# EAGLE design F3-Quad-Brushed-SIDE-USB-JMPR (EAGLE 7.5.0)
Title: F3 Quad Brushed - Side USB Author: Lance Source: Alienflight.com License: CC BY SA <http://creativecommons.org/licenses/by-sa/4.0/>
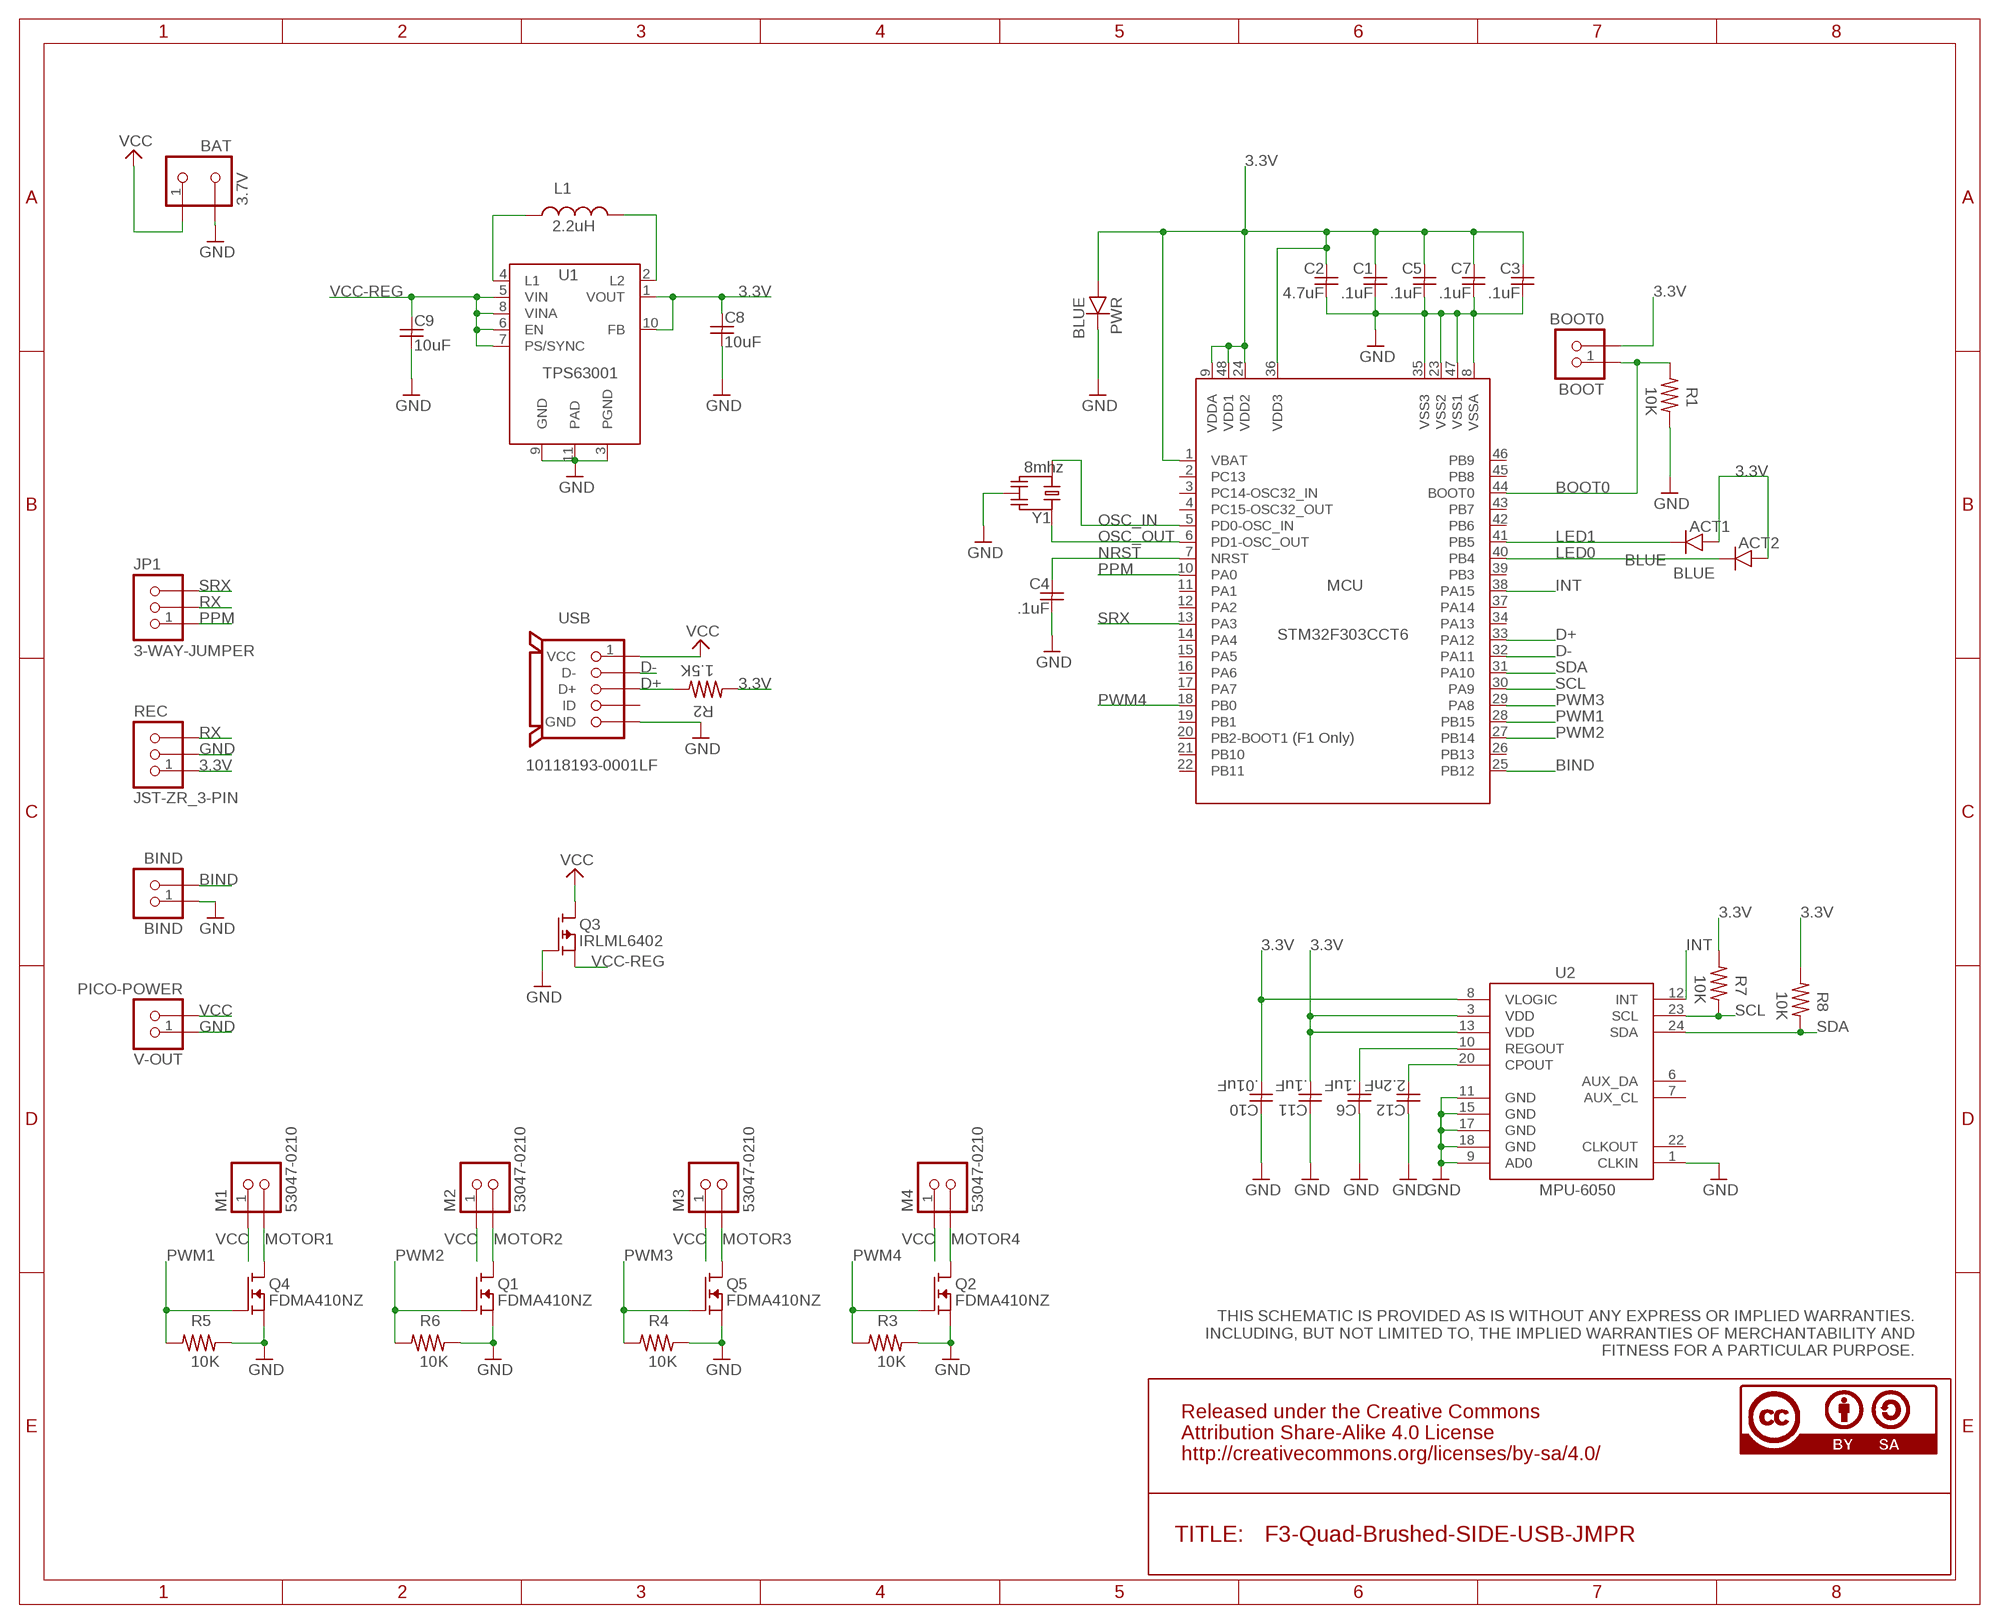
[diagram p0: schematic, sheet 1]

## Parts
ACT1  BLUE  SMD-CHIP-LED-0805  [SMD-CHIP-LED-0805]
ACT2  BLUE  SMD-CHIP-LED-0805  [SMD-CHIP-LED-0805]
BAT  3.7V  JST-PH-BAT  [S2B-PH-K-S]
BIND  BIND  1.27MM-PINHEADX2  [1.27MM-PINHEADX2]
BOOT  BOOT0  1.27MM-PINHEADX2  [1.27MM-PINHEADX2]
C1  .1uF  CAPACITOR.1UF  [MUR-CAP-0603]
C2  4.7uF  CAPACITOR4.7UF  [MUR-CAP-0603]
C3  .1uF  CAPACITOR.1UF  [MUR-CAP-0603]
C4  .1uF  CAPACITOR.1UF  [MUR-CAP-0603]
C5  .1uF  CAPACITOR.1UF  [MUR-CAP-0603]
C6  .1uF  CAPACITOR.1UF  [MUR-CAP-0603]
C7  .1uF  CAPACITOR.1UF  [MUR-CAP-0603]
C8  10uF  CAPACITOR10UF  [YUDEN-CAP-0805]
C9  10uF  CAPACITOR10UF  [YUDEN-CAP-0805]
C10  .01uF  CAPACITOR.01UF  [MUR-CAP-0603]
C11  .1uF  CAPACITOR.1UF  [MUR-CAP-0603]
C12  2.2nF  CAPACITOR2.2NF  [MUR-CAP-0603]
JP1  3-WAY-JUMPER  [3-WAY-JUMPER]
L1  2.2uH  NR301X  [NR301X]
M1  53047-0210  PICO-1.25-MOTOR  [PICO-53047-02]
M2  53047-0210  PICO-1.25-MOTOR  [PICO-53047-02]
M3  53047-0210  PICO-1.25-MOTOR  [PICO-53047-02]
M4  53047-0210  PICO-1.25-MOTOR  [PICO-53047-02]
MCU  STM32F303CCT6  STM32FX03-F3  [LQFP48-7X7]
PWR  BLUE  SMD-CHIP-LED-0805  [SMD-CHIP-LED-0805]
Q1  FDMA410NZ  [MICROFET-2X2]
Q2  FDMA410NZ  [MICROFET-2X2]
Q3  IRLML6402  MOSFET-P  [SOT-23]
Q4  FDMA410NZ  [MICROFET-2X2]
Q5  FDMA410NZ  [MICROFET-2X2]
R1  10K  RESISTOR10K  [VISH-RES-0603]
R2  1.5K  RESISTOR1.5K  [VISH-RES-0603]
R3  10K  RESISTOR10K  [VISH-RES-0603]
R4  10K  RESISTOR10K  [VISH-RES-0603]
R5  10K  RESISTOR10K  [VISH-RES-0603]
R6  10K  RESISTOR10K  [VISH-RES-0603]
R7  10K  RESISTOR10K  [VISH-RES-0603]
R8  10K  RESISTOR10K  [VISH-RES-0603]
REC  JST-ZR_3-PIN  [S3B-ZR]
U1  TPS63001  TPS630XX-TPS63001  [VSON-N10]
U2  MPU-6050  [QFN24-4X4]
USB  10118193-0001LF  USB-MICRO-B-FCI  [10118193-0001LF]
V-OUT  PICO-POWER  [PICO_1.25_.5MM]
Y1  8mhz  RESONATOR8MHZ  [RESONATOR_8]

## Nets
3.3V: ACT1.A ACT2.A BOOT.2 C1.1 C2.1 C3.1 C5.1 C7.1 C8.1 C10.2 C11.2 MCU.1(VBAT) MCU.9(VDDA) MCU.24(VDD2) MCU.36(VDD3) MCU.48(VDD1) PWR.A R2.2 R7.2 R8.2 REC.1 U1.1(VOUT) U1.10(FB) U2.3(VDD) U2.8(VLOGIC) U2.13(VDD)
BIND: BIND.2 MCU.25(PB12)
BOOT0: BOOT.1 MCU.44(BOOT0) R1.2
D+: MCU.33(PA12) R2.1 USB.3(D+)
D-: MCU.32(PA11) USB.2(D-)
GND: BAT.2 BIND.1 C1.2 C2.2 C3.2 C4.2 C5.2 C6.1 C7.2 C8.2 C9.2 C10.1 C11.1 C12.1 MCU.8(VSSA) MCU.23(VSS2) MCU.35(VSS3) MCU.47(VSS1) PWR.C Q1.S Q1.S1(S) Q2.S Q2.S1(S) Q3.1(G) Q4.S Q4.S1(S) Q5.S Q5.S1(S) R1.1 R3.1 R4.1 R5.1 R6.1 REC.2 U1.3(PGND) U1.9(GND) U1.11(PAD) U2.1(CLKIN) U2.9(AD0) U2.11(GND) U2.15(GND) U2.17(GND) U2.18(GND) USB.5(GND) USB.GND USB.GND2(GND) USB.HOLE1(GND) USB.HOLE2(GND) V-OUT.1 Y1.2
INT: MCU.38(PA15) U2.12(INT)
LED0: ACT2.C MCU.40(PB4)
LED1: ACT1.C MCU.41(PB5)
MOTOR1: M1.2 Q4.D Q4.D1(D) Q4.D2(D) Q4.D3(D) Q4.D4(D)
MOTOR2: M2.2 Q1.D Q1.D1(D) Q1.D2(D) Q1.D3(D) Q1.D4(D)
MOTOR3: M3.2 Q5.D Q5.D1(D) Q5.D2(D) Q5.D3(D) Q5.D4(D)
MOTOR4: M4.2 Q2.D Q2.D1(D) Q2.D2(D) Q2.D3(D) Q2.D4(D)
N$1: C6.2 U2.10(REGOUT)
N$7: C12.2 U2.20(CPOUT)
N$8: L1.2 U1.2(L2)
N$9: L1.1 U1.4(L1)
NRST: C4.1 MCU.7(NRST)
OSC_IN: MCU.5(PD0-OSC_IN) Y1.3
OSC_OUT: MCU.6(PD1-OSC_OUT) Y1.1
PPM: JP1.1 MCU.10(PA0)
PWM1: MCU.28(PB15) Q4.G R5.2
PWM2: MCU.27(PB14) Q1.G R6.2
PWM3: MCU.29(PA8) Q5.G R4.2
PWM4: MCU.18(PB0) Q2.G R3.2
RX: JP1.2 REC.3
SCL: MCU.30(PA9) R7.1 U2.23(SCL)
SDA: MCU.31(PA10) R8.1 U2.24(SDA)
SRX: JP1.3 MCU.13(PA3)
VCC [vcc]: BAT.1 M1.1 M2.1 M3.1 M4.1 Q3.3(D) USB.1(VCC) V-OUT.2
VCC-REG [vcc]: C9.1 Q3.2(S) U1.5(VIN) U1.6(EN) U1.7(PS/SYNC) U1.8(VINA)
Unconnected: MCU.2(PC13) MCU.3(PC14-OSC32_IN) MCU.4(PC15-OSC32_OUT) MCU.11(PA1) MCU.12(PA2) MCU.14(PA4) MCU.15(PA5) MCU.16(PA6) MCU.17(PA7) MCU.19(PB1) MCU.20(PB2-BOOT1) MCU.21(PB10) MCU.22(PB11) MCU.26(PB13) MCU.34(PA13) MCU.37(PA14) MCU.39(PB3) MCU.42(PB6) MCU.43(PB7) MCU.45(PB8) MCU.46(PB9) U2.6(AUX_DA) U2.7(AUX_CL) U2.22(CLKOUT) USB.4(ID)

## Notes on the sheet
- THIS SCHEMATIC IS PROVIDED AS IS WITHOUT ANY EXPRESS OR IMPLIED WARRANTIES.
   INCLUDING, BUT NOT LIMITED TO, THE IMPLIED WARRANTIES OF MERCHANTABILITY AND
   FITNESS FOR A PARTICULAR PURPOSE.

## Library data of the parts
ACT1 ACT2 PWR = alienflight:SMD-CHIP-LED-0805: SMD CHIP LED APHCM2012QBC/D-F01 View Datasheet <https://www.kingbrightusa.com/images/catalog/spec/APHCM2012QBC-D-F01.pdf> Author: Lance Source: http://alienflight.com License: CC BY SA <creativecommons.org/licenses/by-sa/4.0/>; MF: Kingbright; MPN: APHCM2012QBC/D-F01
BAT = alienflight:JST-PH-BAT: Battery Connector JST- S2B-PH-K-S View Datasheet <http://www.jst-mfg.com/product/pdf/eng/ePH.pdf> Author: Lance Source: http://alienflight.com License: CC BY SA <creativecommons.org/licenses/by-sa/4.0/>; MF: JST; MPN: S2B-PH-K-S
BIND BOOT = alienflight:1.27MM-PINHEADX2: Jumper 1.27MM Pin Header X2 View Datasheet <http://www.sullinscorp.com/catalogs/82_PAGE90-91_.050_MALE_HDR_ST_RA_SMT.pdf> Author: Lance Source: http://alienflight.com License: CC BY SA <creativecommons.org/licenses/by-sa/4.0/>; MF: Sullins; MPN: GRPB021VWVN-RC (JUMPER IS M50-1930005)
C1 C3-C7 C11 = alienflight:CAPACITOR: CAPACITORS Murata Datasheet <http://www.murata.com/~/media/webrenewal/support/library/catalog/products/capacitor/mlcc/c02e.ashx?la=en-us> Taiyo Yuden Datasheet <http://www.mouser.com/ds/2/396/mlcc11_hq_e-541564.pdf> Author: Lance Source: http://alienflight.com License: CC BY SA <creativecommons.org/licenses/by-sa/4.0/>; MF: Murata; MPN: GRM188R71C104KA01D
C2 = alienflight:CAPACITOR: CAPACITORS Murata Datasheet <http://www.murata.com/~/media/webrenewal/support/library/catalog/products/capacitor/mlcc/c02e.ashx?la=en-us> Taiyo Yuden Datasheet <http://www.mouser.com/ds/2/396/mlcc11_hq_e-541564.pdf> Author: Lance Source: http://alienflight.com License: CC BY SA <creativecommons.org/licenses/by-sa/4.0/>; MF: Murata; MPN: GRJ188C70J475KE11D
C8 C9 = alienflight:CAPACITOR: CAPACITORS Murata Datasheet <http://www.murata.com/~/media/webrenewal/support/library/catalog/products/capacitor/mlcc/c02e.ashx?la=en-us> Taiyo Yuden Datasheet <http://www.mouser.com/ds/2/396/mlcc11_hq_e-541564.pdf> Author: Lance Source: http://alienflight.com License: CC BY SA <creativecommons.org/licenses/by-sa/4.0/>; MF: Taiyo Yuden; MPN: JMK212AB7106KG-T
C10 = alienflight:CAPACITOR: CAPACITORS Murata Datasheet <http://www.murata.com/~/media/webrenewal/support/library/catalog/products/capacitor/mlcc/c02e.ashx?la=en-us> Taiyo Yuden Datasheet <http://www.mouser.com/ds/2/396/mlcc11_hq_e-541564.pdf> Author: Lance Source: http://alienflight.com License: CC BY SA <creativecommons.org/licenses/by-sa/4.0/>; MF: Murata; MPN: GRM188R71C103KA01D
C12 = alienflight:CAPACITOR: CAPACITORS Murata Datasheet <http://www.murata.com/~/media/webrenewal/support/library/catalog/products/capacitor/mlcc/c02e.ashx?la=en-us> Taiyo Yuden Datasheet <http://www.mouser.com/ds/2/396/mlcc11_hq_e-541564.pdf> Author: Lance Source: http://alienflight.com License: CC BY SA <creativecommons.org/licenses/by-sa/4.0/>; MF: Murata; MPN: GRM188R71C222KA01D
JP1 = alienflight:3-WAY-JUMPER: 3 Way Jumper
L1 = alienflight:NR301X: 3X3mm Inductor NR3015T2R2M - Datasheet <http://datasheet.octopart.com/NR3015T2R2M-Taiyo-Yuden-datasheet-41181804.pdf> Author: Lance Source: http://alienflight.com License: CC BY SA <creativecommons.org/licenses/by-sa/4.0/>; MF: Taiyo Yuden; MPN: NR3015T2R2M
M1-M4 = alienflight:PICO-1.25-MOTOR: Motor Connector PicoBlade 1.25 53047-02 View Datasheet <http://www.molex.com/webdocs/datasheets/pdf/en-us/0530470210_PCB_HEADERS.pdf> Author: Lance Source: http://alienflight.com License: CC BY SA <creativecommons.org/licenses/by-sa/4.0/>; MF: MOLEX; MPN: 53047-0210
MCU = alienflight:STM32FX03: STM32F32FX03 Datasheet <http://www.st.com/web/en/resource/technical/document/datasheet/DM00058181.pdf> Author: Lance Source: http://alienflight.com License: CC BY SA <creativecommons.org/licenses/by-sa/4.0/>; MF: ST; MPN: STM32F303CCT6
Q1 Q2 Q4 Q5 = alienflight:FDMA410NZ: N-Channel MOSFET FDMA410NZ View Datasheet <https://www.fairchildsemi.com/datasheets/FD/FDMA410NZ.pdf> Author: Lance Source: http://alienflight.com License: CC BY SA <creativecommons.org/licenses/by-sa/4.0/>; MF: Fairchild; MPN: FDMA410NZ
Q3 = alienflight:MOSFET-P: P-Channel MOSFET IRLML6402 Datasheet <http://www.irf.com/product-info/datasheets/data/irlml6402pbf.pdf> Author: Lance Source: Alienflight.com License: CC BY SA <creativecommons.org/licenses/by-sa/4.0/>; MF: IR; MPN: IRLML6402
R1 R3-R8 = alienflight:RESISTOR: RESISTORS Vishay DataSheet <http://www.vishay.com/docs/20043/crcwhpe3.pdf> Author: Lance Source: http://alienflight.com License: CC BY SA <creativecommons.org/licenses/by-sa/4.0/>; MF: Vishay; MPN: CRCW060310K0FKEAHP
R2 = alienflight:RESISTOR: RESISTORS Vishay DataSheet <http://www.vishay.com/docs/20043/crcwhpe3.pdf> Author: Lance Source: http://alienflight.com License: CC BY SA <creativecommons.org/licenses/by-sa/4.0/>; MF: Vishay; MPN: CRCW06031K50FKEAHP
REC = alienflight:JST-ZR_3-PIN: 3 Pin Receiver JST - S3B-ZR View Datasheet <http://www.jst-mfg.com/product/pdf/eng/eZH.pdf> Author: Lance Source: http://alienflight.com License: CC BY SA <creativecommons.org/licenses/by-sa/4.0/>; MF: JST; MPN: S3B-ZR
U1 = alienflight:TPS630XX: Buck/Boost Converter TPS63001/2 Datasheet <http://www.ti.com/lit/ds/symlink/tps63001.pdf> Author: Lance Source: http://alienflight.com License: CC BY SA <creativecommons.org/licenses/by-sa/4.0/>; MF: TI; MPN: TPS63001DRCR
U2 = alienflight:MPU-6050: MPU-6050 View Datasheet <http://43zrtwysvxb2gf29r5o0athu.wpengine.netdna-cdn.com/wp-content/uploads/2015/02/MPU-6000-Datasheet1.pdf> Author: Lance Source: http://alienflight.com License: CC BY SA <creativecommons.org/licenses/by-sa/4.0/>; MF: Invensense; MPN: MPU-6050
USB = alienflight:USB-MICRO-B: Micro-B USB Connector Author: Lance Source: http://alienflight.com License: CC BY SA <creativecommons.org/licenses/by-sa/4.0/>; MF: FCI; MPN: 10118193-0001LF
V-OUT = alienflight:PICO-POWER: Pico Power Connector Picoblade 53047-0210 View Datasheet <http://www.molex.com/webdocs/datasheets/pdf/en-us/0530470210_PCB_HEADERS.pdf> Author: Lance Source: http://alienflight.com License: CC BY SA <creativecommons.org/licenses/by-sa/4.0/>; MF: Molex; MPN: 53047-0210
Y1 = alienflight:RESONATOR: SMD Ceramic Resonators Ceralock Murata Datasheet <http://www.murata.com/~/media/webrenewal/support/library/catalog/products/timingdevice/ceralock/p16e.ashx> Author: Lance Source: http://alienflight.com License: CC BY SA <creativecommons.org/licenses/by-sa/4.0/>; MF: Murata; MPN: CSTCE8M00G55-R0

## Net classes
0 default: width 0.254 mm, drill 0.33 mm, clearance 0.178 mm
1 vcc: width 0.254 mm, drill 0.33 mm, clearance 0.178 mm

## Board
Title: F3 Quad Brushed - Side USB Author: Lance Source: Alienflight.com License: CC BY SA <http://creativecommons.org/licenses/by-sa/4.0/>
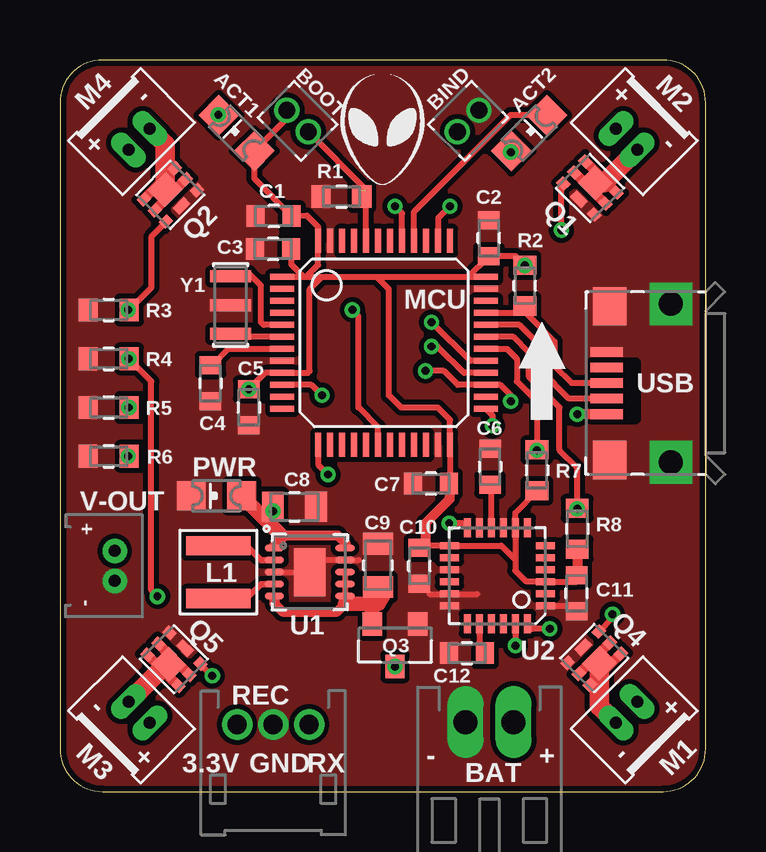
[diagram p1: board, top side]
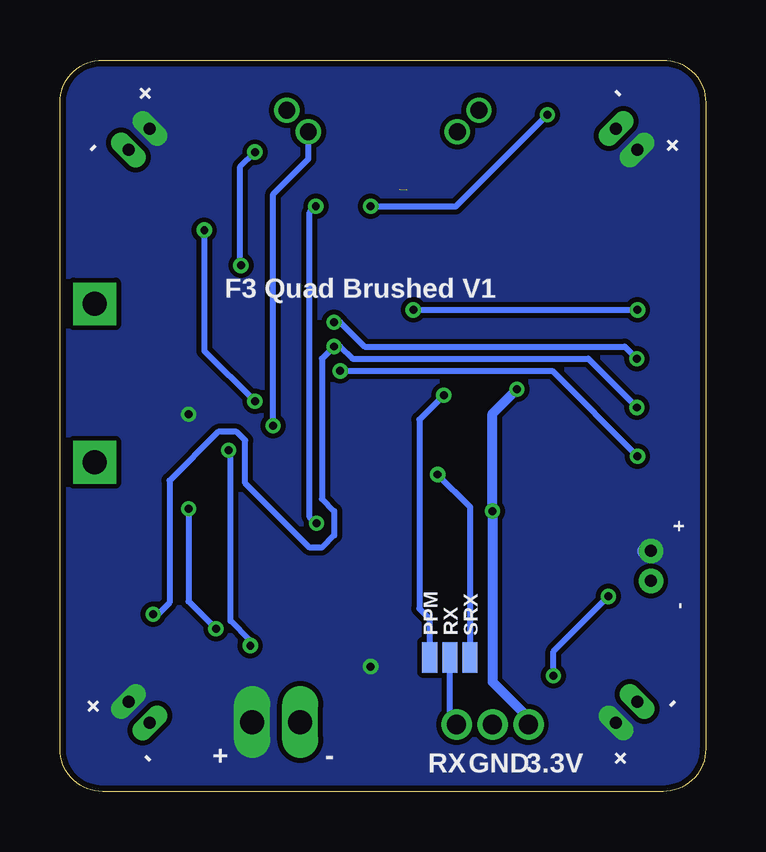
[diagram p2: board, bottom side, seen from below]

Size 26.92 x 30.48 mm. Coordinates in mm from the lower left corner, seen from the top.
Outline: 0,28.7 0,1.78 arc90 1.78,0 25.15,0 arc90 26.92,1.78 26.92,28.7 arc90 25.15,30.48 1.78,30.48 arc90 0,28.7
Copper layers (1*16): Top 0.035mm / dielectric 1.5mm / Bottom 0.035mm
Design rules "Alien-Design-Rules": minimum track width 6mil, minimum drill 12mil, track to track 6mil, track to pad 6mil, pad to pad 6mil, via to via 6mil, smd to smd 0mil, copper to edge 10mil, drill to drill 10mil, minimum pad ring 7mil, minimum via ring 6mil, stop-mask expansion 0mil, vias tented up to drill 20mil, thermal gap 10mil

### Footprints (pad centres in the part's own frame; a part is rotated, then mirrored left to right if it is on the bottom)
SMD-CHIP-LED-0805 = smd 1.2 x 1.2: A -1.05,0; C 1.05,0
S2B-PH-K-S = drill 1 long: 1 1,0; 2 -1,0
1.27MM-PINHEADX2 = drill 0.7: 1 -0.635,0; 2 0.635,0
MUR-CAP-0603 = smd 0.75 x 0.9: 1 -0.75,0; 2 0.75,0
YUDEN-CAP-0805 = smd 0.9 x 1.25: 1 -0.9,0; 2 0.9,0
3-WAY-JUMPER = smd 0.635 x 1.27: 1 -0.84,0; 2 0,0; 3 0.84,0
NR301X = smd 2.7 x 0.8: 1 0,1.1; 2 0,-1.1
PICO-53047-02 = drill 0.5 pad 0.813 long: 1 0.625,0; 2 -0.625,0
LQFP48-7X7 = smd 0.254 x 1: 1 -2.75,-4.25; 2 -2.25,-4.25; 3 -1.75,-4.25; 4 -1.25,-4.25; 5 -0.75,-4.25; 6 -0.25,-4.25; 7 0.25,-4.25; 8 0.75,-4.25; 9 1.25,-4.25; 10 1.75,-4.25; 11 2.25,-4.25; 12 2.75,-4.25; 25 2.75,4.25; 26 2.25,4.25; 27 1.75,4.25; 28 1.25,4.25; 29 0.75,4.25; 30 0.25,4.25; 31 -0.25,4.25; 32 -0.75,4.25; 33 -1.25,4.25; 34 -1.75,4.25; 35 -2.25,4.25; 36 -2.75,4.25 | smd 1 x 0.254: 13 4.25,-2.75; 14 4.25,-2.25; 15 4.25,-1.75; 16 4.25,-1.25; 17 4.25,-0.75; 18 4.25,-0.25; 19 4.25,0.25; 20 4.25,0.75; 21 4.25,1.25; 22 4.25,1.75; 23 4.25,2.25; 24 4.25,2.75; 37 -4.25,2.75; 38 -4.25,2.25; 39 -4.25,1.75; 40 -4.25,1.25; 41 -4.25,0.75; 42 -4.25,0.25; 43 -4.25,-0.25; 44 -4.25,-0.75; 45 -4.25,-1.25; 46 -4.25,-1.75; 47 -4.25,-2.25; 48 -4.25,-2.75
MICROFET-2X2 = smd 1 x 1.05: D -0.3,0 | smd 0.4 x 0.47: D1 -0.65,0.915; D2 0,0.915; D3 -0.65,-0.915; D4 0,-0.915; G 0.65,-0.915; S1 0.65,0.915 | smd 0.4 x 0.66: S 0.65,0
SOT-23 = smd 0.802 x 0.972: 1 -0.95,-0.885; 2 0.95,-0.885; 3 0,0.885
VISH-RES-0603 = smd 0.8 x 0.95: 1 -0.85,0; 2 0.85,0
S3B-ZR = drill 0.8 pad 1.27: 1 -1.5,0; 2 0,0; 3 1.5,0
VSON-N10 = smd 0.8 x 0.26: 1 -1.475,1; 2 -1.475,0.5; 3 -1.475,0; 4 -1.475,-0.5; 5 -1.475,-1; 6 1.475,-1; 7 1.475,-0.5; 8 1.475,0; 9 1.475,0.5; 10 1.475,1 | smd 1.3 x 2: 11 0,0
QFN24-4X4 = smd 0.8 x 0.3: 1 -2,1.25; 2 -2,0.75; 3 -2,0.25; 4 -2,-0.25; 5 -2,-0.75; 6 -2,-1.25; 13 2,-1.25; 14 2,-0.75; 15 2,-0.25; 16 2,0.25; 17 2,0.75; 18 2,1.25 | smd 0.3 x 0.8: 7 -1.25,-2; 8 -0.75,-2; 9 -0.25,-2; 10 0.25,-2; 11 0.75,-2; 12 1.25,-2; 19 1.25,2; 20 0.75,2; 21 0.25,2; 22 -0.25,2; 23 -0.75,2; 24 -1.25,2
10118193-0001LF = smd 0.4 x 1.35: 1 1.3,-4.125; 2 0.65,-4.125; 3 0,-4.125; 4 -0.65,-4.125; 5 -1.3,-4.125 | smd 1.6 x 1.4: GND -3.2,-4; GND2 3.2,-4 | drill 1 pad 1.778 square: HOLE1 -3.3,-1.45; HOLE2 3.3,-1.45
PICO_1.25_.5MM = drill 0.5 pad 1.016: 1 0.625,0; 2 -0.625,0
RESONATOR_8 = smd 0.5 x 1.7: 1 -1.2,0; 2 0,0; 3 1.2,0

### Placement (x,y rotation side)
ACT1  7.37,27.43 135 top
ACT2  19.56,27.43 45 top
BAT  17.91,2.9 0 top
BIND  17.02,27.94 225 top
BOOT  9.91,27.94 135 top
C1  8.92,23.98 180 top
C2  17.88,23.06 90 top
C3  8.89,22.61 180 top
C4  6.27,17.02 270 top
C5  7.87,16 270 top
C6  17.93,13.54 270 top
C7  15.47,12.83 180 top
C8  9.78,11.86 0 top
C9  13.26,9.42 90 top
C10  14.99,9.4 90 top
C11  21.54,8.26 90 top
C12  16.97,5.77 0 top
JP1  10.67,5.59 0 bottom
L1  6.6,9.14 180 top
M1  23.62,3.3 45 top
M2  23.62,27.18 135 top
M3  3.3,3.3 315 top
M4  3.3,27.18 225 top
MCU  13.51,18.69 270 top
PWR  6.53,12.32 180 top
Q1  22.1,25.15 225 top
Q2  4.6,24.86 315 top
Q3  13.97,6.1 180 top
Q4  22.28,5.56 135 top
Q5  4.75,5.51 45 top
R1  11.73,24.79 0 top
R2  19.38,21.08 90 top
R3  2.03,20.07 0 top
R4  2.03,18.03 0 top
R5  2.03,16 0 top
R6  2.03,13.97 0 top
R7  19.89,13.39 270 top
R8  21.56,10.95 270 top
REC  8.89,2.79 0 top
U1  10.41,9.14 0 top
U2  18.24,8.99 180 top
U$1  [ALIENHEADSMALL]  13.46,27.94 0 top
U$2  [ARROW]  20.07,17.02 0 top
USB  26.92,17.02 270 top
V-OUT  2.29,9.4 270 top
Y1  7.11,20.27 90 top

### Tracks (layer width: path | path; a pad name or v marks a point on that pad's centre or on a via)
3.3V  (via drill 0.33)
  Top 0.254: U1.1 8.91,10.23 8.91,10.24 | 11.91,10.27 U1.10 | C11.2 21.54,8.74 U2.3 19.45,8.74 18.99,9.21 18.99,9.65 | 19.94,12.45 R7.2 18.99,11.61 U2.8 18.99,9.65 | 18.99,9.65 18.4,10.24 U2.13 15.08,10.24 C10.2 | 8.13,26.92 ACT1.A | 8.38,26.92 8.13,26.92 | 8.13,26.92 ACT1.A | v19.38,21.92 19.37,22.02 R2.2 19,22.31 C2.1 17.02,21.44 | ACT2.A v18.8,26.64 | 8.13,26.67 ACT1.A | 10.27,21.44 10.92,21.44 | 10.92,21.44 13.21,21.44 | 13.21,21.44 17.02,21.44 | 17.02,21.44 MCU.36 | MCU.1 10.16,21.44 | 10.16,21.44 10.27,21.44 | 10.27,21.44 10.76,21.94 MCU.48 10.76,23.53 10.29,24 C1.1 8.11,25.54 ACT1.A | 10.92,21.44 10.41,20.94 10.41,17.53 10.33,17.44 MCU.9 8.55,17.44 v7.87,16.76 C5.1 | C7.1 16.26,13.05 MCU.24 16.26,15.49 15.75,16 14.22,16 13.72,16.51 13.72,20.94 13.21,21.44 | 19.36,22.02 v19.38,21.92 | C3.1 9.64,21.96 10.16,21.44 | 19.28,21.84 v19.38,21.92 | C8.1 8.88,11.7 v8.89,11.68 | BOOT.2 9.46,28.04 ACT1.A
  Top 0.305: 11.91,10.27 11.92,10.2
  Top 0.406: 11.91,10.27 11.91,10.34 11.58,10.67 9.37,10.67 9.26,10.55 | 9.26,10.55 8.94,10.23 8.91,10.23 | R8.2 21.57,9.01 C11.2 | 9.26,10.55 9.26,10.64 9.18,10.72 9.18,10.86 8.89,11.15 v8.89,11.68 8.9,11.68 | C10.2 15.24,10.4 15.24,11.18 16.26,12.19 16.26,12.79 C7.1 16.07,12.68
  Top 0.61: 9.18,10.72 PWR.A 7.73,12.42
  Bottom 0.254: v18.8,26.64 19.41,26.04 19.41,21.95 v19.38,21.92
  Bottom 0.406: v7.87,16.76 8.89,15.75 v8.89,11.68 8.89,4.57 7.39,3.07 REC.1
BIND  (via drill 0.33)
  Top 0.254: MCU.25 18.03,15.67 v18.03,15.24
  Bottom 0.254: v18.03,15.24 18.03,24.89 16.57,26.36 BIND.2
BOOT0  (1 unrouted)
  Top 0.254: MCU.44 12.76,25.08 BOOT.1 | R1.2 12.46,25.04
D+
  Top 0.254: USB.3 21.34,17.02 20.62,17.73 20.62,18.75 19.43,19.94 19.3,19.94 | MCU.33 19.3,19.94 | R2.1 19.36,20 19.3,19.94
D-
  Top 0.254: USB.2 21.22,16.37 20.07,17.53 20.07,18.54 19.16,19.44 MCU.32
GND
  Top 0.254: U1.3 U1.11 10.41,9.65 10.42,9.64 U1.9 12.45,9.64 | U2.1 21.57,7.74 C11.1 | 15.42,8.23 17.4,8.23
  pour Top (isolate 0.203, no thermals): 0.1,28.5 0.1,1.83 arc90 1.88,0.05 24.99,0.05 arc90 26.77,1.83 26.77,28.5 arc90 24.99,30.28 1.88,30.28 arc90
INT  (via drill 0.33)
  Top 0.254: MCU.38 15.76,23.89 v16.26,24.38 | U2.12 16.8,11.18 v16.23,11.18
  Bottom 0.254: 16.48,24.16 v16.26,24.38 16.51,24.13 16.51,11.43 16.26,11.18 v16.23,11.18
LED0
  Top 0.254: 20.32,28.19 ACT2.C | 20.07,27.94 ACT2.C | ACT2.C 20.28,28.19 18.8,28.19 14.76,24.16 MCU.40
LED1  (via drill 0.33)
  Top 0.254: MCU.41 14.26,24.09 v13.97,24.38 | v6.6,28.19 6.86,27.94 ACT1.C
  Bottom 0.254: v13.97,24.38 10.41,24.38 v6.6,28.19
MOTOR1
  Top 0.406: Q4.D1 22.47,4.83 22.49,4.83 22.49,4.85 Q4.D3 | Q4.D4 | Q4.D1 | Q4.D2 22.07,5.34 Q4.D 22.49,5.77 Q4.D4
  Top 0.813: Q4.D 22.49,4.83 22.49,3.55 M1.2
MOTOR2
  Top 0.406: Q1.D4 21.89,25.36 Q1.D | Q1.D2 22.31,24.93 Q1.D | Q1.D1 22.79,25.37 | 22.79,25.37 22.79,25.47 | Q1.D3 22.76,25.4 | 22.76,25.4 22.86,25.4 22.82,25.36 Q1.D | 22.76,25.4 22.79,25.37
  Top 0.813: 22.69,25.36 22.79,25.47 M2.2
MOTOR3
  Top 0.406: Q5.D2 4.54,5.73 Q5.D | Q5.D4 4.96,5.3 Q5.D | Q5.D3 4.54,4.81 Q5.D | Q5.D1 4.13,5.22 4.13,5.01
  Top 0.813: M3.2 4.13,5.01 4.42,5.3 Q5.D
MOTOR4
  Top 0.406: Q2.D1 | Q2.D2 | Q2.D4 | Q2.D2 4.82,25.07 Q2.D 4.39,24.65 Q2.D4 | Q2.D3 4.39,25.57 4.39,25.65 | Q2.D1 4.73,25.91 4.39,25.91
  Top 0.813: M4.2 4.39,26.97 4.39,25.91 4.39,25.65 Q2.D
N$1
  Top 0.254: U2.10 17.99,12.73 C6.2
N$7
  Top 0.254: U2.20 17.49,5.56 C12.2
N$8
  Top 0.279: U1.2 8.39,9.64 7.87,10.16 6.7,10.16 L1.2
N$9
  Top 0.279: U1.4 8.39,8.64 7.87,8.13 6.69,8.13 L1.1
NRST
  Top 0.254: C4.1 6.34,17.77 7.01,18.44 MCU.7
OSC_IN
  Top 0.254: MCU.5 8.5,19.44 8.38,19.56 8.38,21.08 7.87,21.59 7.23,21.59 Y1.3 7.13,21.46
OSC_OUT
  Top 0.254: MCU.6 7.24,18.94 Y1.1
PPM  (via drill 0.33)
  Top 0.254: v10.92,16.51 10.49,16.94 MCU.10
  Bottom 0.254: v10.92,16.51 11.94,15.49 11.94,7.62 11.51,7.19 JP1.1
PWM1  (via drill 0.33)
  Top 0.254: v2.87,16 R5.2 | Q4.G 23.04,7.24 v23.04,7.39 | MCU.28 16.85,17.44 15.75,18.54 v15.49,18.54
  Bottom 0.254: v2.87,16 4.9,18.03 14.73,18.03 15.24,18.54 v15.49,18.54 16,18.03 16,12.19 15.49,11.68 15.49,10.67 16,10.16 16.51,10.16 19.2,12.85 19.2,14.63 19.56,14.99 20.32,14.99 22.35,12.95 22.35,7.87 22.84,7.39 v23.04,7.39
PWM2  (via drill 0.33)
  Top 0.254: v18.8,16.26 18.8,16.51 18.36,16.94 MCU.27 16.58,16.94 16,17.53 v15.24,17.53 | R6.2 v2.85,13.97 | v20.9,23.39 20.9,25.25 Q1.G
  Bottom 0.254: v20.9,23.39 20.9,18.36 v18.8,16.26 | v15.24,17.53 6.4,17.53 v2.85,13.97
PWM3  (via drill 0.33)
  Top 0.254: R4.2 3.05,18.03 | Q5.G 5.84,5.31 6.33,4.83 v6.35,4.83 | v4.06,8.13 3.81,8.38 3.81,17.09 v2.87,18.03 | MCU.29 17.11,17.94 v15.49,19.56
  Top 0.406: R4.2 v2.87,18.03
  Bottom 0.254: v2.87,18.03 3.38,18.54 14.22,18.54 15.24,19.56 v15.49,19.56 | v6.35,4.83 6.35,5.84 v4.06,8.13
PWM4  (via drill 0.33)
  Top 0.254: MCU.18 13.26,15.19 12.45,16 12.45,19.81 v12.19,20.07 | Q2.G 4.42,23.72 3.81,23.11 3.81,20.99 R3.2
  Top 0.406: R3.2 v2.85,20.07
  Bottom 0.254: v12.19,20.07 v2.85,20.07
RX
  Bottom 0.254: REC.3 10.67,3.07 JP1.2
SCL  (via drill 0.33)
  Top 0.254: U2.23 v18.99,6.08 | MCU.30 18.64,18.44 19.05,18.03 19.05,17.09 19.89,16.26 v19.89,14.22
  Top 0.305: R7.1 v19.89,14.22 19.96,14.22
  Bottom 0.254: v18.99,6.08 18.99,6.29 19.81,7.11 19.81,14.15 v19.89,14.22
SDA  (via drill 0.33)
  Top 0.254: v20.42,6.78 19.7,6.78 U2.24 | v21.57,11.79 R8.1 21.57,13.49 20.83,14.22 20.83,16 19.56,17.27 19.56,18.29 18.9,18.94 MCU.31
  Bottom 0.254: v21.57,11.79 21.57,7.92 v20.42,6.78
SRX  (via drill 0.33)
  Top 0.254: MCU.13 10.76,13.62 v11.18,13.21
  Bottom 0.254: v11.18,13.21 9.83,11.86 JP1.3
VCC  (via drill 0.33)
  Top 0.406: USB.1 v21.57,15.72
  Top 0.61: Q3.3
  Bottom 0.61: V-OUT.2 2.56,10.01
  other vias: 13.97,5.21
  pour Bottom (isolate 0.203, no thermals): 0.1,28.5 0.1,1.83 arc90 1.88,0.05 24.99,0.05 arc90 26.77,1.83 26.77,28.5 arc90 24.99,30.28 1.88,30.28 arc90
VCC-REG
  Top 0.254: U1.5 8.94,7.98 | U1.8 U1.7 U1.6
  Top 0.406: 8.94,7.98 8.94,7.83 9.27,7.49 11.56,7.49 11.89,7.83 U1.6 | 12.94,7.17 13.02,7.17
  Top 0.61: 13.22,7.85 C9.1 13.47,8.15 13.47,8.14 13.27,7.83 12.95,7.83 | 11.89,7.83 12.95,7.83 | 12.95,7.83 13.02,7.76 13.02,7.17 Q3.2

### Text on the board
bPlace: SRX | RX | PPM
bNames: F3 Quad Brushed V1
Guide: Released under the Creative Commons Attribution Share-Alike 4.0 License / http://creativecommons.org/licenses/by-sa/4.0/ | THIS BOARD DESIGN IS PROVIDED AS IS WITHOUT ANY EXPRESS OR IMPLIED WARRANTIES. / INCLUDING, BUT NOT LIMITED TO, THE IMPLIED WARRANTIES OF MERCHANTABILITY AND / FITNESS FOR A PARTICULAR PURPOSE.